# Altium schematic sheet power.SchDoc
size Letter
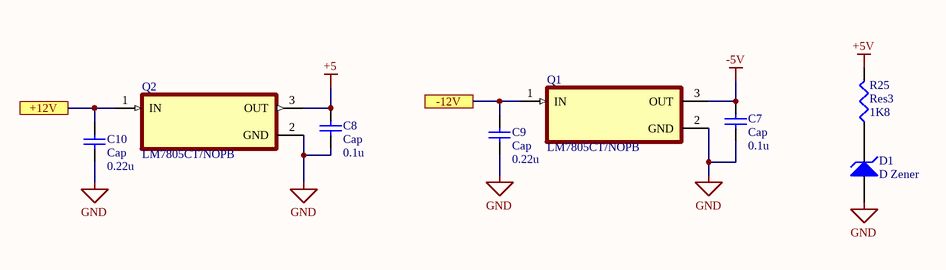
[diagram p0: power.SchDoc]

## Parts
C7  Cap  value 0.1u  [RAD-0.3]
C8  Cap  value 0.1u  [RAD-0.3]
C9  Cap  value 0.22u  [RAD-0.3]
C10  Cap  value 0.22u  [RAD-0.3]
D1  D Zener  [DIODE-0.7]
Q1  LM7805CT/NOPB  [TO254P1054X470X1955-3]
Q2  LM7805CT/NOPB  [TO254P1054X470X1955-3]
R25  Res3  value 1K8  [J1-0603]

## Ports
+12V, -12V

## Nets
+5: C8.2 Q2.3(OUT)
+5V: R25.2
-5V: C7.2 Q1.3(OUT)
GND: C7.1 C8.1 C9.1 C10.1 D1.1(A) Q1.2(GND) Q2.2(GND)
+12V: C10.2 Q2.1(IN) ; port +12V
-12V: C9.2 Q1.1(IN) ; port -12V
NetD1_2: D1.2(K) R25.1

## Library data of the parts
C7-C10 = Cap: Capacitor; Published: 8-Jun-2000; LatestRevisionDate: 17-Jul-2002; LatestRevisionNote: Re-released for DXP Platform.; PackageReference: RAD-0.3; Publisher: Altium Limited; PackageDescription: Radial Cap, Thru-Hole; 2 Leads; 0.3 in Pin Spacing
D1 = D Zener: Zener Diode; Published: 8-Jun-2000; LatestRevisionDate: 17-Jul-2002; LatestRevisionNote: Re-released for DXP Platform.; PackageReference: DIODE-0.7; Publisher: Altium Limited; PackageDescription: Diode, Thru-Hole; 2 Leads; 0.7 in Pin Spacing
Q1 Q2 = LM7805CT/NOPB: 1.5-A, 30-V, linear voltage regulator 3-TO-220 0 to 125; MF: Texas Instruments; Package: TO-220-3 Texas Instruments; Texas_Instruments-Purchase-URL: https://snapeda.com/shop?store=Texas+Instruments&id=6627; Value: *; Price: None; MP: LM7805CT/NOPB; Availability: Unavailable; SnapEDA_Link: https://www.snapeda.com/parts/LM7805CT/NOPB/Texas%20Instruments/view-part/6627/?ref=snap
R25 = Res3: Resistor; Published: 8-Jun-2000; LatestRevisionDate: 29-May-2009; LatestRevisionNote: IPC-7351 Footprint Added.; PackageReference: J1-0603; Publisher: Altium Limited; PackageDescription: Chip Resistor